# EAGLE design Pyun2Controler2 (EAGLE 7.2.0)
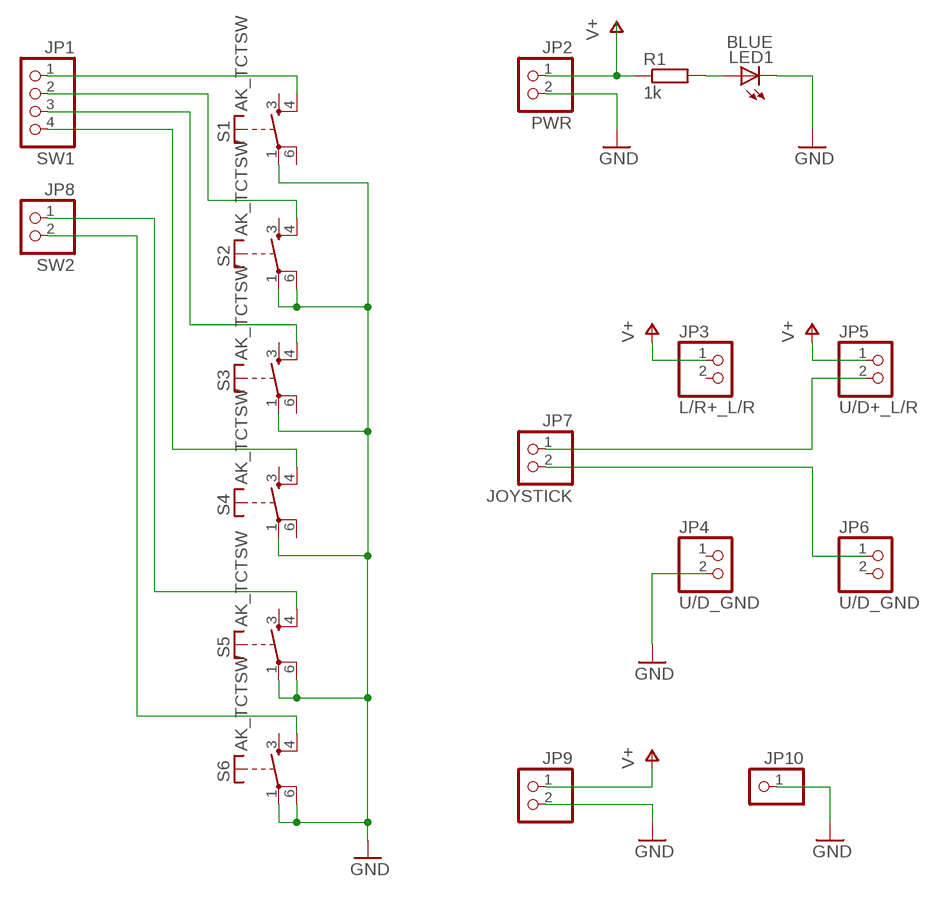
[diagram p0: schematic, sheet 1]

## Parts
JP1  SW1  PINHD-1X4/90  [1X04/90]
JP2  PWR  PINHD-1X2/90  [1X02/90]
JP3  L/R+_L/R  PINHD-1X2  [1X02]
JP4  U/D_GND  PINHD-1X2  [1X02]
JP5  U/D+_L/R  PINHD-1X2  [1X02]
JP6  U/D_GND  PINHD-1X2  [1X02]
JP7  JOYSTICK  PINHD-1X2/90  [1X02/90]
JP8  SW2  PINHD-1X2/90  [1X02/90]
JP9  PINHD-1X2/90  [1X02/90]
JP10  PINHD-1X1  [1X01]
LED1  BLUE  LED3MM  [LED3MM]
R1  1k  R-EU_0207/7  [0207/7]
S1  AK_TCTSW  [TME1]
S2  AK_TCTSW  [TME1]
S3  AK_TCTSW  [TME1]
S4  AK_TCTSW  [TME1]
S5  AK_TCTSW  [TME1]
S6  AK_TCTSW  [TME1]

## Nets
GND: JP2.2 JP4.2 JP9.2 JP10.1 LED1.K(C) S1.1(P) S2.1(P) S2.6(P) S3.1(P) S4.1(P) S5.1(P) S5.6(P) S6.1(P) S6.6(P)
N$1: JP1.1 S1.4(S)
N$2: JP1.2 S2.4(S)
N$3: JP1.3 S3.4(S)
N$4: JP1.4 S4.4(S)
N$5: LED1.A R1.2
N$6: JP5.2 JP7.1
N$7: JP6.1 JP7.2
N$8: JP8.1 S5.4(S)
N$9: JP8.2 S6.4(S)
V+: JP2.1 JP3.1 JP5.1 JP9.1 R1.1
Unconnected: JP3.2 JP4.1 JP6.2 S1.3(S) S1.6(P) S2.3(S) S3.3(S) S3.6(P) S4.3(S) S4.6(P) S5.3(S) S6.3(S)

## Library data of the parts
JP1 = pinhead:PINHD-1X4: PIN HEADER
JP2-JP9 = pinhead:PINHD-1X2: PIN HEADER
JP10 = pinhead:PINHD-1X1: PIN HEADER
LED1 = led:LED: LED OSRAM: - CHIPLED LG R971, LG N971, LY N971, LG Q971, LY Q971, LO R971, LY R971 LH N974, LH R974 LS Q976, LO Q976, LY Q976 LO Q996 - Hyper CHIPLED LW Q18S LB Q993, LB Q99A, LB R99A - SideLED LS A670, LO A670, LY A670, LG A670, LP A670 LB A673, LV A673, LT A673, LW A673 LH A674 LY A675 LS A676, LA A676, LO A676, LY A676, LW A676 LS A679, LY A679, LG A679 - Hyper Micro SIDELED® LS Y876, LA Y876, LO Y876, LY Y876 LT Y87S - SmartLED LW L88C, LW L88S LB L89C, LB L89S, LG L890 LS L89K, LO L89K, LY L89K LS L896, LA L896, LO L896, LY L896 - TOPLED LS T670, LO T670, LY T670, LG T670, LP T670 LSG T670, LSP T670, LSY T670, LOP T670, LYG T670 LG T671, LOG T671, LSG T671 LB T673, LV T673, LT T673, LW T673 LH T674 LS T676, LA T676, LO T676, LY T676, LB T676, LH T676, LSB T676, LW T676 LB T67C, LV T67C, LT T67C, LS T67K, LO T67K, LY T67K, LW E67C LS E67B, LA E67B, LO E67B, LY E67B, LB E67C, LV E67C, LT E67C LW T67C LS T679, LY T679, LG T679 LS T770, LO T770, LY T770, LG T770, LP T770 LB T773, LV T773, LT T773, LW T773 LH T774 LS E675, LA E675, LY E675, LS T675 LS T776, LA T776, LO T776, LY T776, LB T776 LHGB T686 LT T68C, LB T68C - Hyper Mini TOPLED® LB M676 - Mini TOPLED Santana® LG M470 LS M47K, LO M47K, LY M47K Source: http://www.osram.convergy.de LUXEON: - LUMILED® LXK2-PW12-R00, LXK2-PW12-S00, LXK2-PW14-U00, LXK2-PW14-V00 LXK2-PM12-R00, LXK2-PM12-S00, LXK2-PM14-U00 LXK2-PE12-Q00, LXK2-PE12-R00, LXK2-PE12-S00, LXK2-PE14-T00, LXK2-PE14-U00 LXK2-PB12-K00, LXK2-PB12-L00, LXK2-PB12-M00, LXK2-PB14-N00, LXK2-PB14-P00, LXK2-PB14-Q00 LXK2-PR12-L00, LXK2-PR12-M00, LXK2-PR14-Q00, LXK2-PR14-R00 LXK2-PD12-Q00, LXK2-PD12-R00, LXK2-PD12-S00 LXK2-PH12-R00, LXK2-PH12-S00 LXK2-PL12-P00, LXK2-PL12-Q00, LXK2-PL12-R00 Source: www.luxeon.com KINGBRIGHT: KA-3528ASYC Source: www.kingbright.com
R1 = rcl:R-EU_: RESISTOR, European symbol
S1-S6 = mylib:AK_TCTSW

## Board
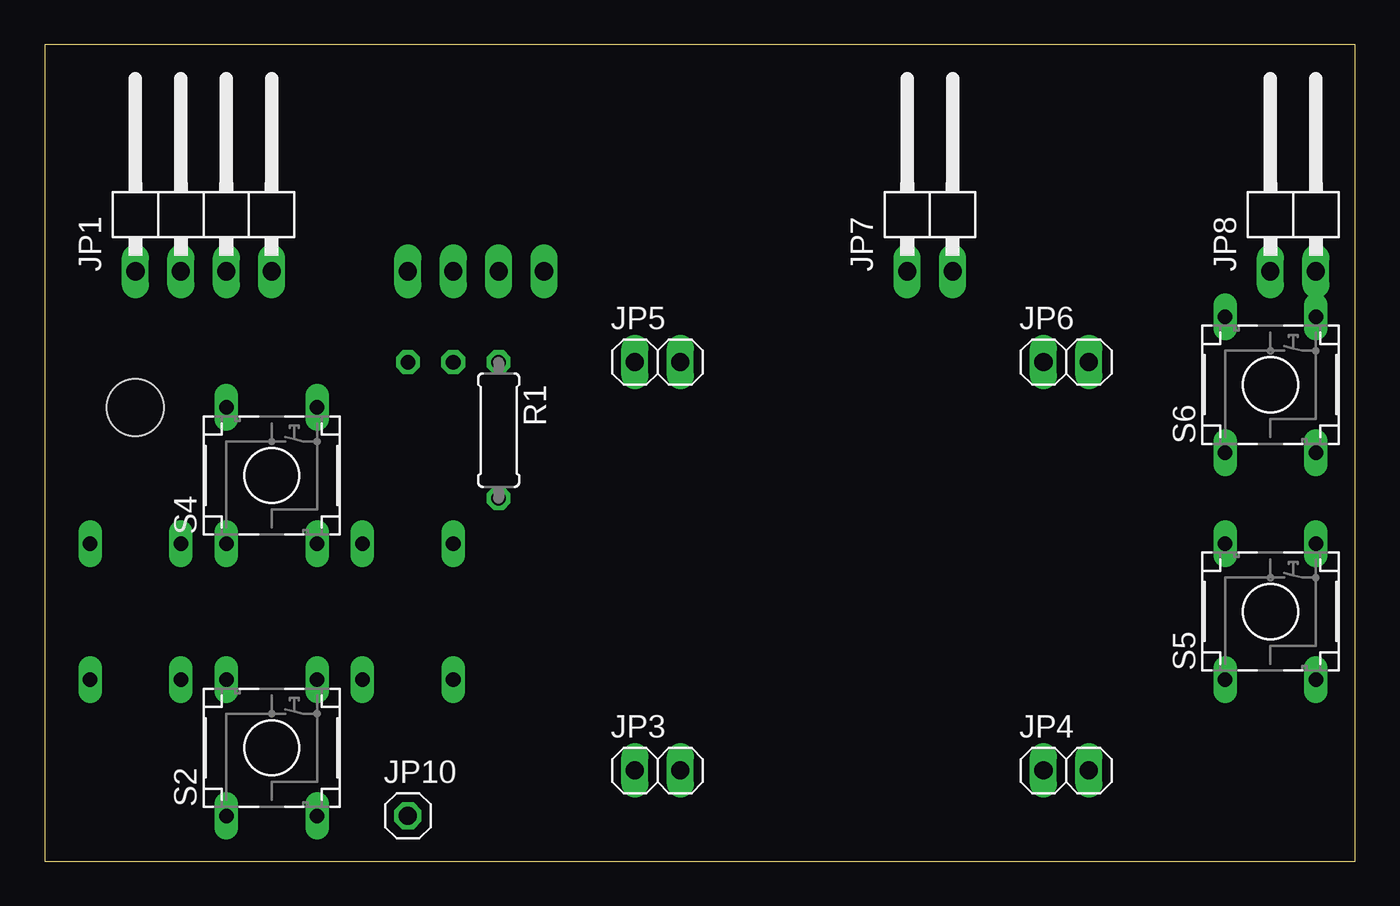
[diagram p1: board, top side]
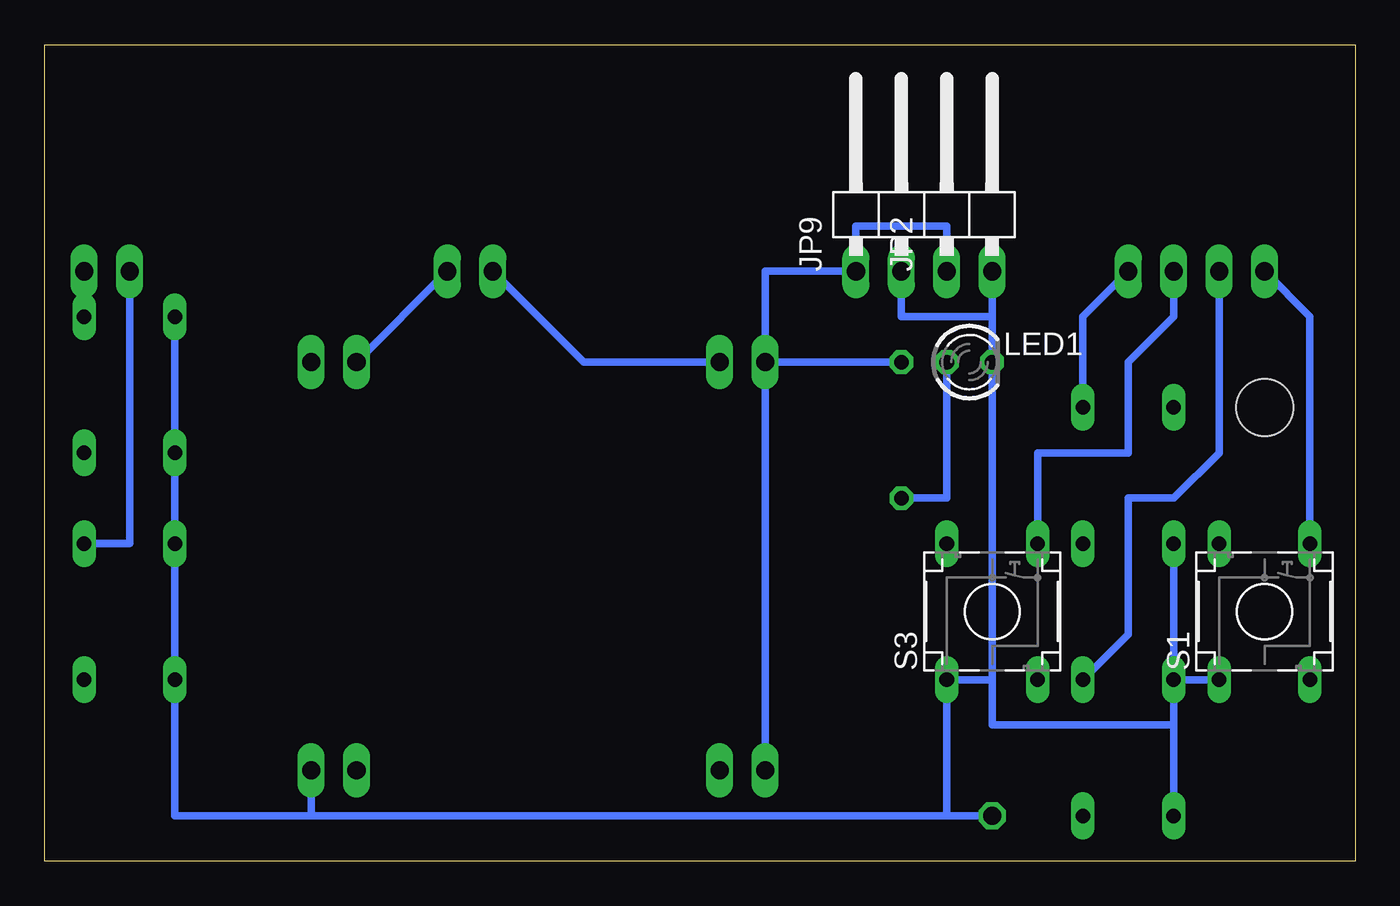
[diagram p2: board, bottom side, seen from below]

Size 73.33 x 45.71 mm. Coordinates in mm from the lower left corner, seen from the top.
Outline: 0,0 73.33,0 73.33,45.71 0,45.71 0,0
Copper layers (1*16): Top 0.035mm / dielectric 1.5mm / Bottom 0.035mm
Design rules "default": minimum track width 10mil, minimum drill 24mil, track to track 8mil, track to pad 8mil, pad to pad 8mil, via to via 8mil, smd to smd 8mil, copper to edge 40mil, drill to drill 8mil, minimum pad ring 10mil, minimum via ring 8mil, stop-mask expansion 4mil, vias tented up to drill 0mil, thermal gap 10mil
Holes 3.2 mm at 5.08,25.4

### Footprints (pad centres in the part's own frame; a part is rotated, then mirrored left to right if it is on the bottom)
1X04/90 = drill 1.016 long: 1 -3.81,-3.81; 2 -1.27,-3.81; 3 1.27,-3.81; 4 3.81,-3.81
1X02/90 = drill 1.016 long: 1 -1.27,-3.81; 2 1.27,-3.81
1X02 = drill 1.016 long: 1 -1.27,0; 2 1.27,0
1X01 = drill 1.016 octagon: 1 0,0
LED3MM = drill 0.813 octagon: A -1.27,0; K 1.27,0
0207/7 = drill 0.813 octagon: 1 -3.81,0; 2 3.81,0
TME1 = drill 0.813 long: 1 -2.54,-3.81; 3 2.54,-3.81; 4 2.54,3.81; 6 -2.54,3.81

### Placement (x,y rotation side)
JP1  8.89,36.83 0 top
JP2  21.59,36.83 0 bottom
JP3  34.29,5.08 0 top
JP4  57.15,5.08 0 top
JP5  34.29,27.94 0 top
JP6  57.15,27.94 0 top
JP7  49.53,36.83 0 top
JP8  69.85,36.83 0 top
JP9  26.67,36.83 0 bottom
JP10  20.32,2.54 0 top
LED1  21.59,27.94 0 bottom
R1  25.4,24.13 270 top
S1  5.08,13.97 0 bottom
S2  12.7,6.35 0 top
S3  20.32,13.97 0 bottom
S4  12.7,21.59 0 top
S5  68.58,13.97 0 top
S6  68.58,26.67 0 top

### Tracks (layer width: path | path; a pad name or v marks a point on that pad's centre or on a via)
GND
  Bottom 0.406: S2.6 S1.1 | S2.6 S4.1 | S2.6 10.16,7.62 | 10.16,7.62 S2.1 | 20.32,10.16 LED1.K 20.32,30.48 | 20.32,10.16 20.32,7.62 10.16,7.62 | 20.32,10.16 S3.1 22.86,2.54 | JP2.2 20.32,30.48 | S6.6 S6.1 S5.6 S5.1 66.04,2.54 58.42,2.54 | JP9.2 25.4,30.48 20.32,30.48 | 22.86,2.54 58.42,2.54 | JP4.2 58.42,2.54 | JP10.1 22.86,2.54
N$1
  Bottom 0.406: JP1.1 2.54,30.48 S1.4
N$2
  Bottom 0.406: JP1.2 7.62,22.86 10.16,20.32 12.7,20.32 12.7,12.7 S2.4
N$3
  Bottom 0.406: JP1.3 10.16,30.48 12.7,27.94 12.7,22.86 17.78,22.86 S3.4
N$4
  Bottom 0.406: JP1.4 15.24,30.48 S4.4
N$5
  Bottom 0.406: LED1.A 22.86,20.32 R1.2
N$6
  Bottom 0.406: JP7.1 43.18,27.94 JP5.2
N$7
  Bottom 0.406: JP7.2 JP6.1
N$8
  Bottom 0.406: JP8.1 68.58,17.78 S5.4
N$9
  Bottom 0.406: JP8.2 S6.4
V+
  Bottom 0.406: JP5.1 JP3.1 | JP5.1 33.02,33.02 JP9.1 27.94,35.56 22.86,35.56 JP2.1 | R1.1 JP5.1